# Altium schematic sheet ConnectorSch.SchDoc
size A
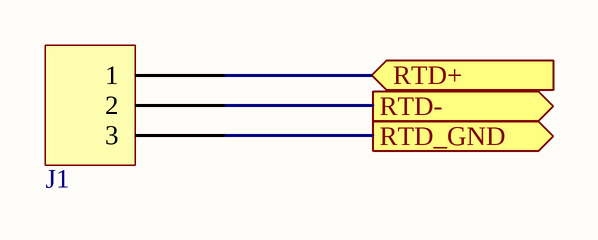
[diagram p0: ConnectorSch.SchDoc]

## Parts
J1  0022272031  [MOLEX KK 0022272031]  (value not drawn)

## Ports
RTD+ (in), RTD- (out), RTD_GND (out)

## Nets
RTD+: J1.1 ; port RTD+
RTD-: J1.2 ; port RTD-
RTD_GND: J1.3 ; port RTD_GND

## Library data of the parts
J1 = 0022272031: CONN HEADER 3POS .100 VERT TIN; Manufacturer: Molex, LLC; Pitch: 0.100" (2.54mm); Number Of Positions: 3; Part Number: 0022272031; PartId: 9720; Supplier 1: Digi-Key; Supplier Part Number 1: WM4112-ND; ComponentLink1Description: Datasheet; ComponentLink1URL: http://www.molex.com/pdm_docs/sd/022272031_sd.pdf; ComponentLink2Description: Digi-Key Listing; ComponentLink2URL: http://www.digikey.com/product-search/en?keywords=22-27-2031; Price: 0.35; Type: Header, Unshrouded; Contact Finish: Tin; Fastening Type: Friction Lock; Number Of Rows: 1; Colour: Natural; Series: KK 6410